# Altium schematic sheet Peripherals.SchDoc
size A3; DocumentNumber: 8; SheetNumber: 8; SheetTotal: 9; PageSetup: Record=PageOptions|CenterHorizontal=True|CenterVertical=True|PrintScale=0.97|XCorrection=1.00|YCorrection=1.00|PrintKind=1|BorderSize=5000000|LeftOffset=0|BottomOffset=0|Orientation=2|PaperLength=2970|PaperWidth=2100|Scale=100|PaperSource=7|PrintQuality=600|MediaType=1|DitherType=10|PaperKind=A4|PrintScaleMode=1
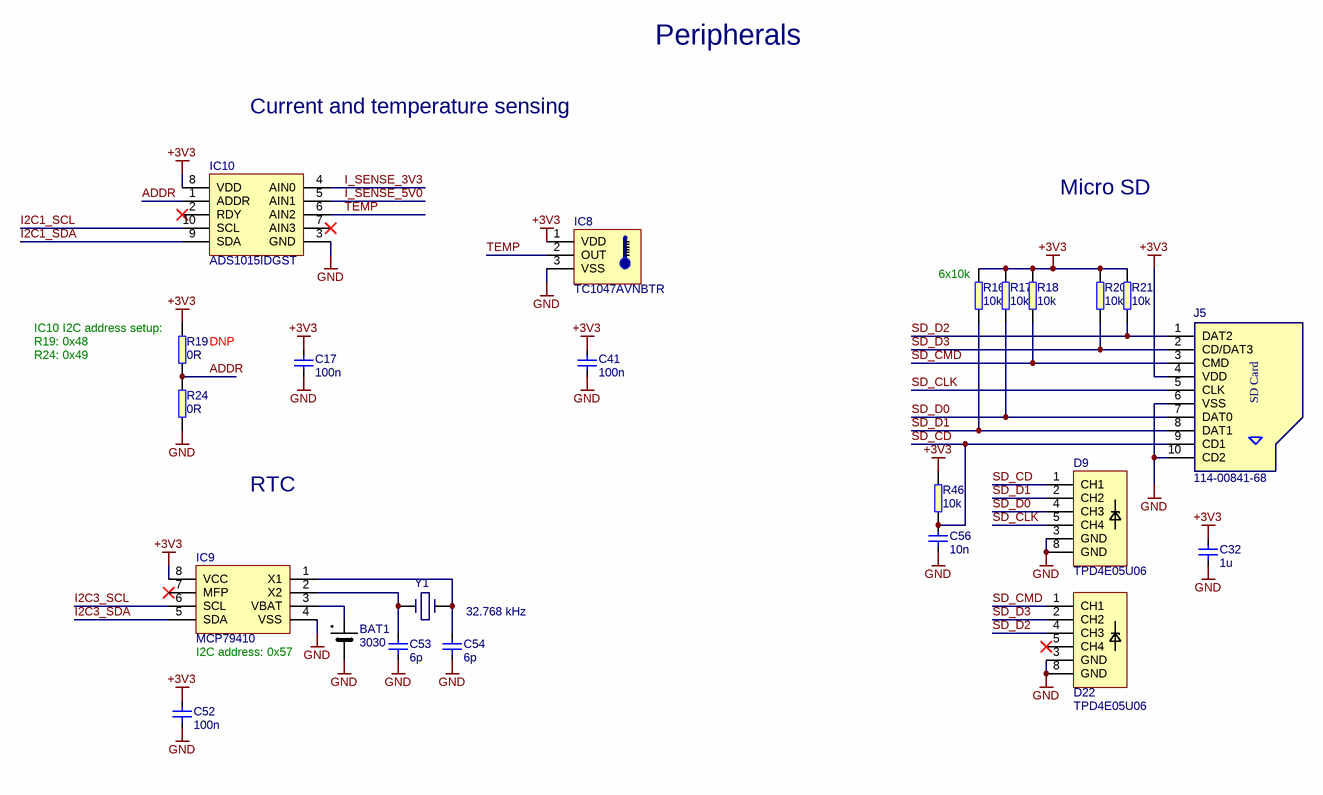
[diagram p0: Peripherals.SchDoc]

## Parts
BAT1  3030  [KEYSTONE_CR1025]
C17  100n  [0402]
C32  1u  [0402]
C41  100n  [0402]
C52  100n  [0402]
C53  6p  [0402]
C54  6p  [0402]
C56  10n  [0402]
D9  TPD4E05U06  [TPD4E05U06_PASS]
D22  TPD4E05U06  [TPD4E05U06_PASS]
IC8  TC1047AVNBTR  [SOT-23]
IC9  MCP79410  [SOIC-8]
IC10  ADS1015IDGST  [MSOP10]
J5  114-00841-68  [114-00841-68]
R16  10k  [0402]
R17  10k  [0402]
R18  10k  [0402]
R19  0R  [0603]
R20  10k  [0402]
R21  10k  [0402]
R24  0R  [0603]
R46  10k  [0402]
Y1  32.768 kHz  [ABS25]

## Nets
+3V3: C17.1 C32.2 C41.1 C52.2 IC8.1(VDD) IC9.8(VCC) IC10.8(VDD) J5.4(VDD) R16.2 R17.2 R18.2 R19.2 R20.2 R21.2 R46.2
GND: BAT1.- C17.2 C32.1 C41.2 C52.1 C53.1 C54.1 C56.1 D9.3(GND) D9.8(GND) D22.3(GND) D22.8(GND) IC8.3(VSS) IC9.4(VSS) IC10.3(GND) J5.6(VSS) J5.10(CD2) R24.1
ADDR: IC10.1(ADDR) R19.1 R24.2
I2C1_SCL: IC10.10(SCL)
I2C1_SDA: IC10.9(SDA)
I2C3_SCL: IC9.6(SCL)
I2C3_SDA: IC9.5(SDA)
I_SENSE_3V3: IC10.4(AIN0)
I_SENSE_5V0: IC10.5(AIN1)
SD_CD: C56.2 D9.1(CH1) J5.9(CD1) R46.1
SD_CLK: D9.5(CH4) J5.5(CLK)
SD_CMD: D22.1(CH1) J5.3(CMD) R18.1
SD_D0: D9.4(CH3) J5.7(DAT0) R17.1
SD_D1: D9.2(CH2) J5.8(DAT1) R16.1
SD_D2: D22.4(CH3) J5.1(DAT2) R21.1
SD_D3: D22.2(CH2) J5.2(CD/DAT3) R20.1
TEMP: IC8.2(OUT) IC10.6(AIN2)
NetBAT1_+: BAT1.+ IC9.3(VBAT)
NetC53_2: C53.2 IC9.2(X2) Y1.2
NetC54_2: C54.2 IC9.1(X1) Y1.1

Not connected (* = marked no-connect by the designer): D22 5(CH4)*; IC9 7(MFP)*; IC10 2(RDY)* 7(AIN3)*

## Notes on the sheet
- Peripherals
- Current and temperature sensing
- Micro SD
- (near R19) IC10 I2C address setup:
- (near R16) 6x10k
- R19: 0x48
- R24: 0x49
- (near R19) DNP
- RTC
- (near IC9) I2C address: 0x57
- Title:
- Size:
- Date:
- A3
- Revision:
- Page:
- of
- Antmicro Ltd.
- File:
- www.antmicro.com
- (in symbol Micro_SD) SD Card

## Library data of the parts
BAT1 = battery: SMT holder for  CR1025 battery; Manufacturer: Keystone; Part Number: Keystone_CR1025; Value: 3030; Part Symbol: 3030; MPN: 3030
C17 C41 C52 = C_100n_0402: MLCC SMT Capacitor 100n 0402; Manufacturer: TDK; Part Symbol: C1005X5R0J104K050BA; Value: 100n; Part Number: C_100n_0402; MPN: C1005X5R0J104K050BA
C32 = C_1u_0402: MLCC SMT Capacitor 1uF 0402; Manufacturer: MULTICOMP; Part Symbol: MC0402F105Z6R3CT; Value: 1u; Part Number: C_1u_0402; MPN: MC0402F105Z6R3CT
C53 C54 = C_6p_0402: MLCC SMT Capacitor 6pF 0402; Manufacturer: WALSIN; Part Symbol: 0402N6R0D500CT; Value: 6p; Part Number: C_6p_0402; MPN: 0402N6R0D500CT
C56 = C_10n_0402: MLCC SMT Capacitor 10 nF 0402; Manufacturer: AVX; Part Symbol: 04025G103ZAT2A; Value: 10n; Part Number: C_10n_0402; MPN: 04025G103ZAT2A
D9 D22 = TPD4E05U06_PASS: ESD Suppressors 4-CH; Manufacturer: Texas Instruments; Part Symbol: TPD4E05U06DQAR; Part Number: TPD4E05U06_PASS; Value: TPD4E05U06; MPN: TPD4E05U06DQAR
IC8 = TC1047A: Precision Temperature-to-Voltage Converter; Manufacturer: MICROCHIP; Part Number: TC1047A; Value: TC1047AVNBTR; Part Symbol: TC1047AVNBTR; MPN: TC1047AVNBTR
IC9 = MCP79410: RTC timer with EEPROM and I2C interface; Manufacturer: MICROCHIP; Part Symbol: MCP79410-I/SN; Part Number: MCP79410; Value: MCP79410; MPN: MCP79410-I/SN
IC10 = ADS1015: ADC 12BIT 4CH I2C; Manufacturer: TEXAS INSTRUMENTS; Part Number: ADS1015IDGST; Value: ADS1015IDGST; Part Symbol: ADS1015IDGST; MPN: ADS1015IDGST
J5 = Micro_SD: Micro SD card holder; Part Number: AMP-114-00841-68; Manufacturer: AMPHENOL COMMERCIAL PRODUCTS; Value: 114-00841-68; Part Symbol: 114-00841-68; MPN: 114-00841-68
R16-R18 R20 R21 R46 = R_10k_0402: RES, 10k, 0402; Manufacturer: MULTICOMP; Part Symbol: MCMR04X1002FTL; Value: 10k; Part Number: R_10k_0402; MPN: MCMR04X1002FTL
R19 R24 = R_0R_0603: RES, 0R, 0603; Manufacturer: BOURNS; Part Symbol: CR0603-J/-000ELF; Value: 0R; Part Number: R_0R_0603; MPN: CR0603-J/-000ELF
Y1 = ABS25-32.768KHZ-6-T: CRYSTAL, 32.768KHz, 6PF, SMD; Manufacturer: ABRACON; Value: 32.768 kHz; Part Number: ABS25-32.768KHZ-6-T; Part Symbol: ABS25-32.768KHZ-6-T; MPN: ABS25-32.768KHZ-6-T